# EAGLE design Tiny45Logic (EAGLE 7.7.0)
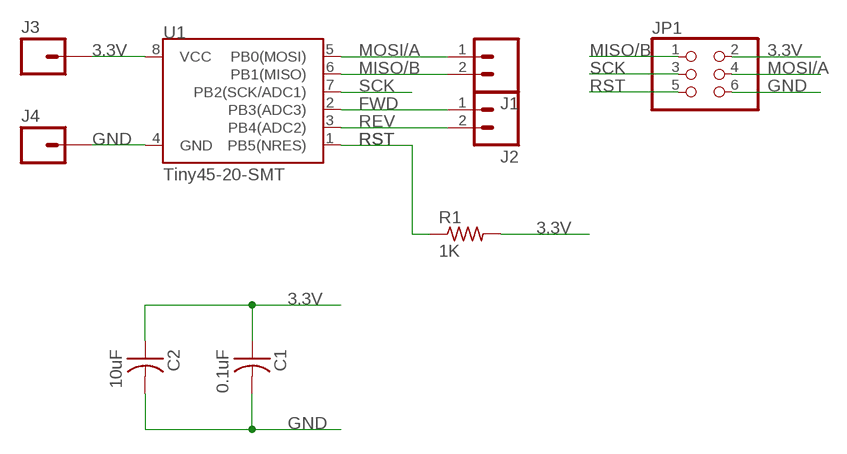
[diagram p0: schematic, sheet 1]

## Parts
C1  0.1uF  CAP-US1206FAB  [C1206FAB]
C2  10uF  CAP-US1206FAB  [C1206FAB]
J1  M02PTH  [1X02]
J2  M02PTH  [1X02]
J3  M01PTH  [1X01]
J4  M01PTH  [1X01]
JP1  PINHD-2X3-SMD  [2X03SMD]
R1  1K  RES-US1206  [R1206]
U1  Tiny45-20-SMT  ATTINY45TINY45-20-SMT  [SO08-EIAJ]

## Nets
3.3V: C1.1 C2.1 J3.1 JP1.2 R1.2 U1.8(VCC)
FWD: J2.1 U1.2(PB3(ADC3))
GND: C1.2 C2.2 J4.1 JP1.6 U1.4(GND)
MISO/B: J1.2 JP1.1 U1.6(PB1(MISO))
MOSI/A: J1.1 JP1.4 U1.5(PB0(MOSI))
REV: J2.2 U1.3(PB4(ADC2))
RST: JP1.5 R1.1 U1.1(PB5(NRES))
SCK: JP1.3 U1.7(PB2(SCK/ADC1))

## Library data of the parts
C1 C2 = fab:CAP-US
J1 J2 = SparkFun-Connectors:M02: Standard 2-pin 0.1" header. Use with - straight break away headers ( PRT-00116) - right angle break away headers (PRT-00553) - swiss pins (PRT-00743) - machine pins (PRT-00117) - female headers (PRT-00115) Molex polarized connector foot print use with: PRT-08233 with associated crimp pins and housings. 2.54_SCREWTERM for use with PRT-10571. 3.5mm Screw Terminal footprints for PRT-08084 5mm Screw Terminal footprints for use with PRT-08432
J3 J4 = SparkFun-Connectors:M01: Header 1 Standard 1-pin 0.1" header. Use with straight break away headers (SKU : PRT-00116), right angle break away headers (PRT-00553), swiss pins (PRT-00743), machine pins (PRT-00117), and female headers (PRT-00115). SMTSO-256-ET is a "flush mount" nut for a 4-40 screw. The older package used to be too tight, and did not allow it to sit properly thru the drill hit. The latest (0.165DIA) fits nice and snug.
JP1 = fab:PINHD-2X3-SMD: PIN HEADER
R1 = fab:RES-US: Resistor (US Symbol) Variants with postfix FAB are widened to allow the routing of internal traces
U1 = SparkFun-DigitalIC:ATTINY45: Atmel 8-pin 2/4/8kB flash uC; PROD_ID: IC-08922

## Board
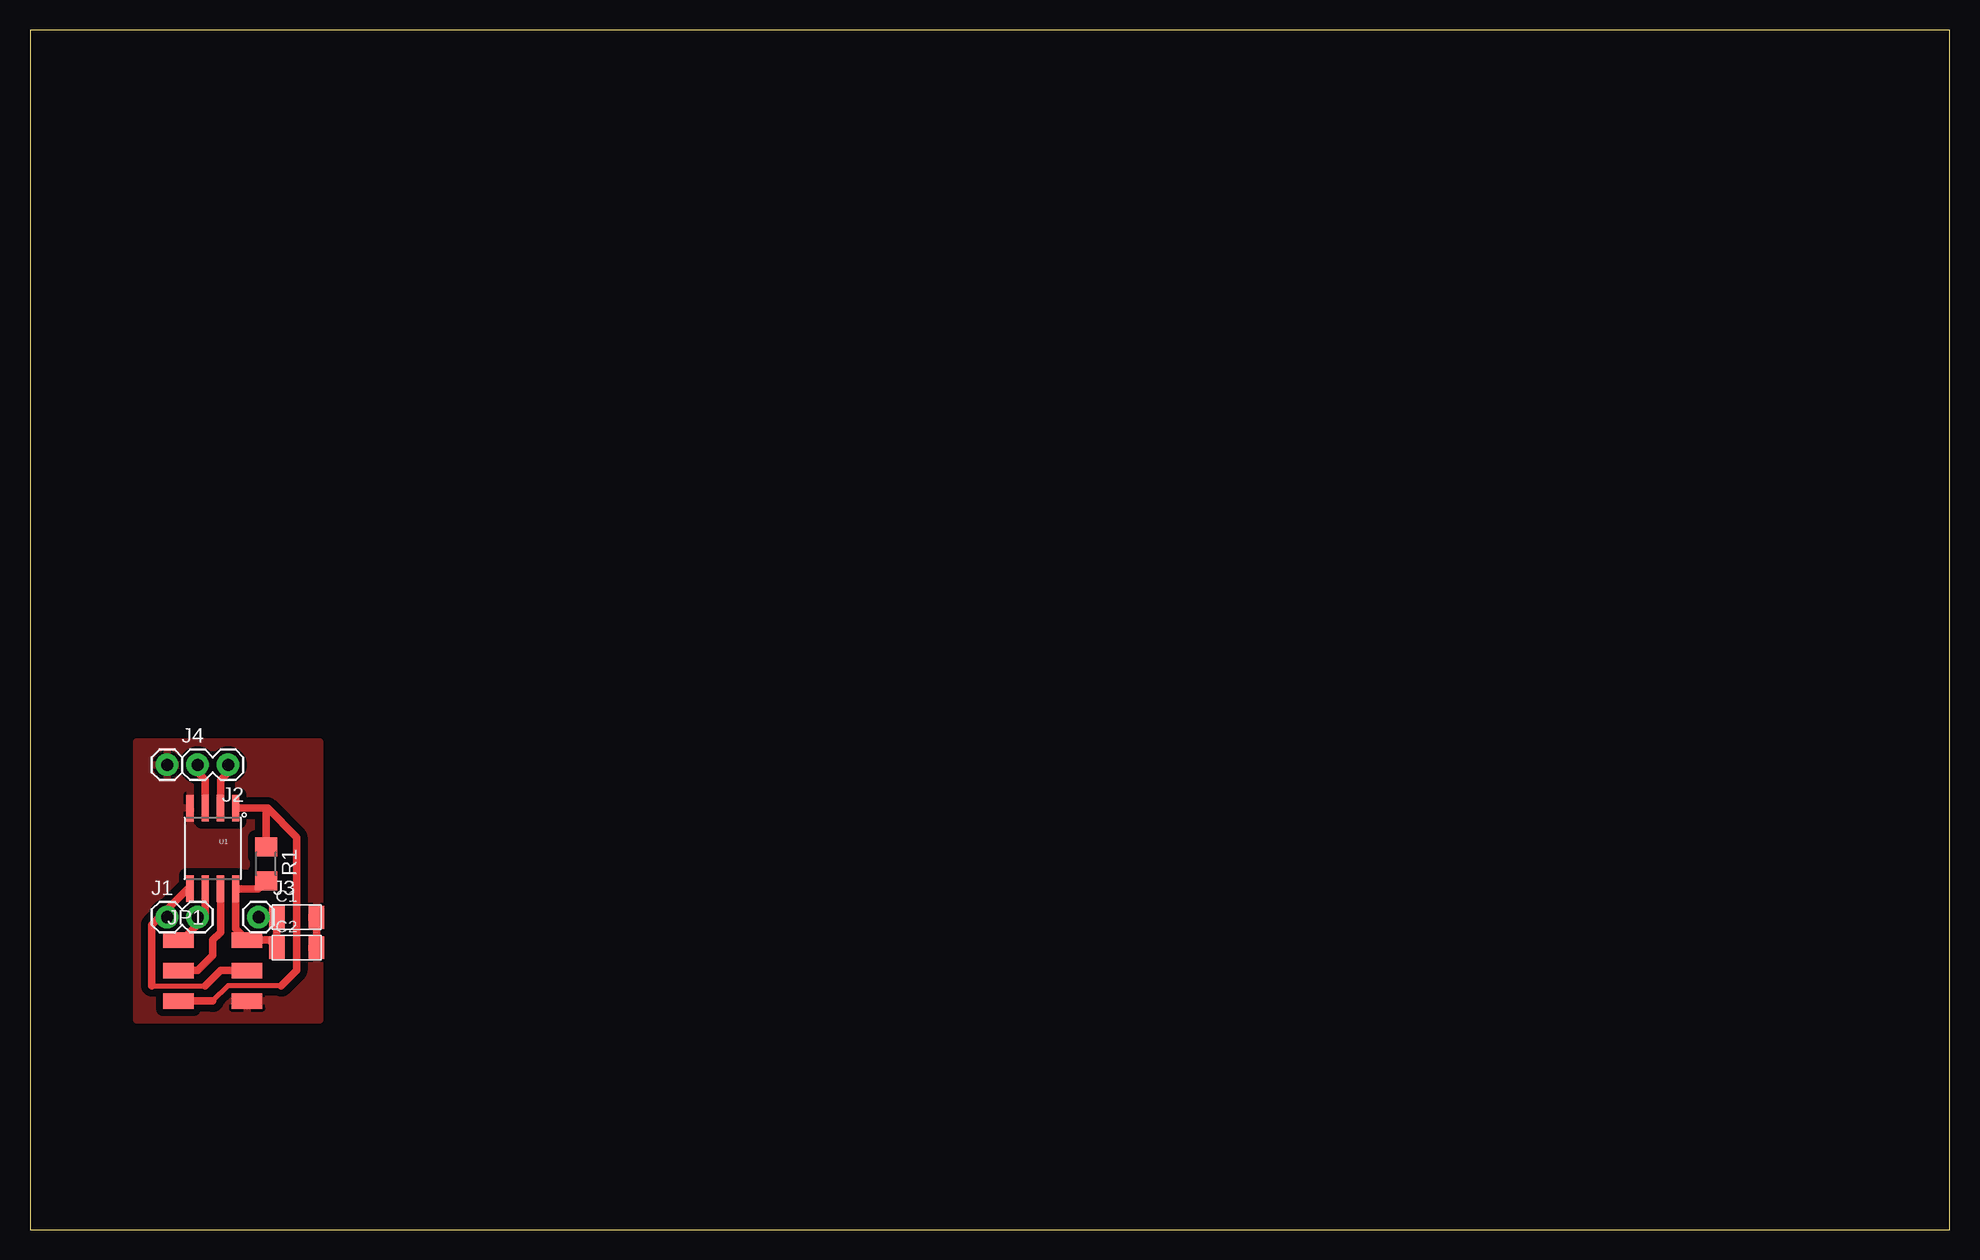
[diagram p1: board, top side]

Size 160 x 100 mm. Coordinates in mm from the lower left corner, seen from the top.
Outline: 0,0 160,0 160,100 0,100 0,0
Copper layers (1*16): Top 0.035mm / dielectric 1.5mm / Bottom 0.035mm
Design rules "default": minimum track width 10mil, minimum drill 24mil, track to track 8mil, track to pad 8mil, pad to pad 8mil, via to via 8mil, smd to smd 8mil, copper to edge 40mil, drill to drill 8mil, minimum pad ring 10mil, minimum via ring 8mil, stop-mask expansion 4mil, vias tented up to drill 0mil, thermal gap 10mil

### Footprints (pad centres in the part's own frame; a part is rotated, then mirrored left to right if it is on the bottom)
C1206FAB = smd 1.27 x 1.905: 1 -1.651,0; 2 1.651,0
1X02 = drill 1.016 pad 1.88: 1 0,0; 2 2.54,0
1X01 = drill 1.016 pad 1.88: 1 0,0
2X03SMD = smd 2.54 x 1.27: 1 -2.857,2.54; 2 2.857,2.54; 3 -2.857,0; 4 2.857,0; 5 -2.857,-2.54; 6 2.857,-2.54
R1206 = smd 1.6 x 1.803: 1 -1.422,0; 2 1.422,0
SO08-EIAJ = smd 0.61 x 2.21: 1 -1.905,-3.378; 2 -0.635,-3.378; 3 0.635,-3.378; 4 1.905,-3.378; 5 1.905,3.353; 6 0.635,3.353; 7 -0.635,3.353; 8 -1.905,3.353

### Placement (x,y rotation side)
C1  22.23,26.04 0 top
C2  22.23,23.5 0 top
J1  11.43,26.04 0 top
J2  16.51,38.73 180 top
J3  19.05,26.04 0 top
J4  11.43,38.73 0 top
JP1  15.24,21.59 0 top
R1  19.68,30.48 270 top
U1  15.24,31.75 180 top

### Tracks (layer width: path | path; a pad name or v marks a point on that pad's centre or on a via)
3.3V
  Top 0.61: R1.2 19.02,28.4 U1.8 17.14,25.08 JP1.2 19.94,24.13 C2.1 20.57,25.15 20.32,25.4 20.32,25.78 C1.1 J3.1
FWD
  Top 0.61: U1.2 15.88,37.47 16.51,38.1 J2.1
GND
  Top 0.61: C1.2 C2.2
  pour Top (isolate 0.61): 8.89,40.64 24.13,40.64 24.13,17.46 8.89,17.46
MISO/B
  Top 0.61: JP1.1 12.7,24.13 14.29,25.72 | 14.29,25.72 14.61,26.04 U1.6 | J1.2 14.29,25.72
MOSI/A
  Top 0.406: 10.16,20.32 14.61,20.32
  Top 0.61: U1.5 13.16,28.4 11.11,26.35 | 11.11,26.35 10.16,25.4 10.16,20.32 | JP1.4 15.88,21.59 14.61,20.32 | J1.1 11.11,26.35
REV
  Top 0.61: U1.3 14.61,37.47 13.97,38.1 J2.2
RST
  Top 0.406: 20.95,20.32 16.51,20.32 15.24,19.05
  Top 0.61: 15.24,19.05 JP1.5 | U1.1 19.68,35.13 | 19.68,35.13 19.8,35.13 22.23,32.7 22.23,21.59 20.95,20.32 | R1.1 19.68,35.13
SCK
  Top 0.61: U1.7 15.88,24.77 15.24,24.13 15.24,22.86 13.97,21.59 JP1.3